# Altium schematic sheet RelayPCB1.3_schematic.schdoc
size 234 x 183 mm
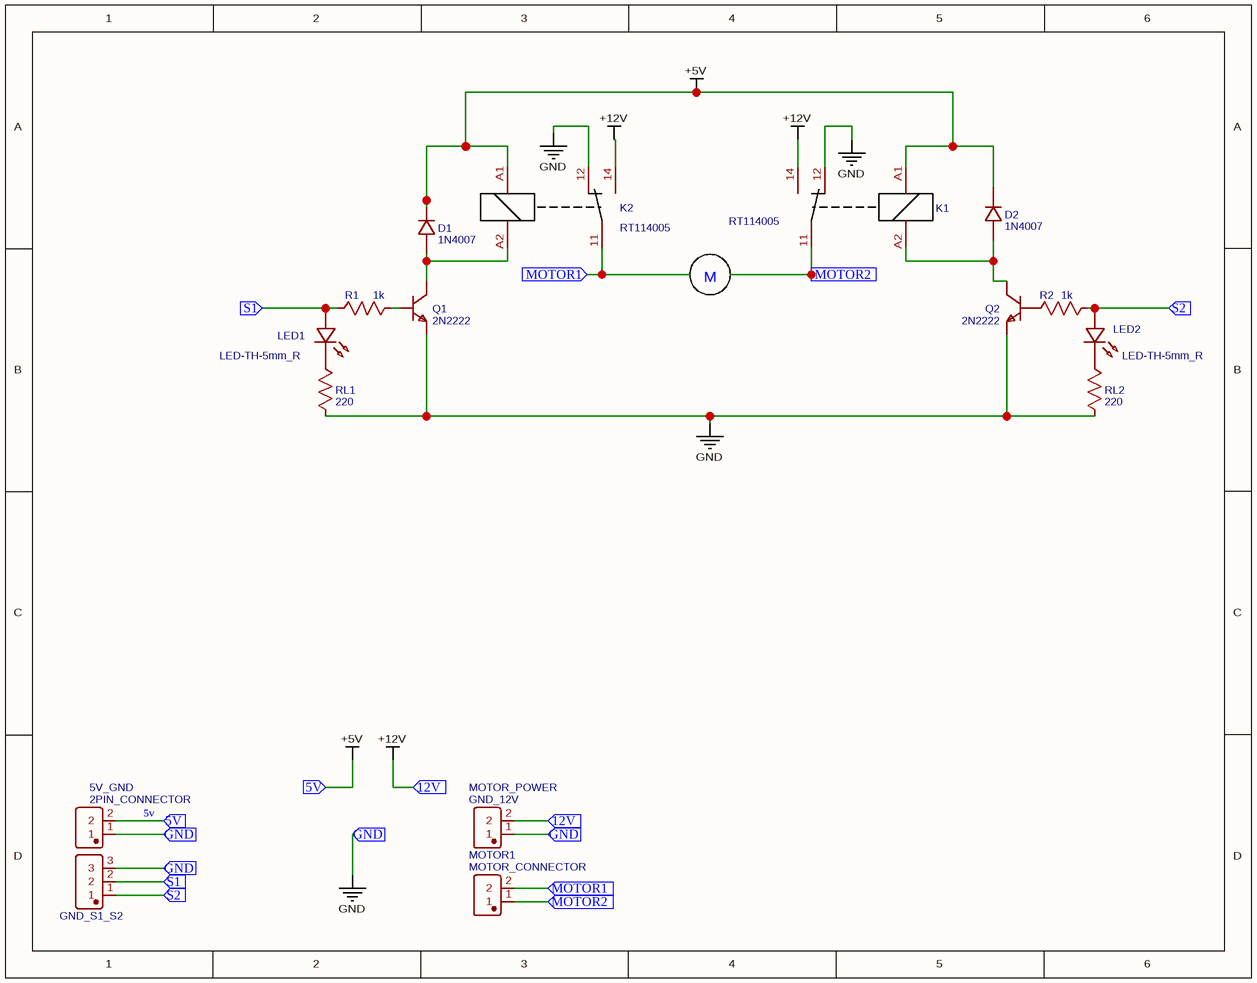
[diagram p0: RelayPCB1.3_schematic.schdoc]

## Parts
5V_GND  2PIN_CONNECTOR  [CONN-TH_XY126V-5.0-2P]
D1  1N4007  [DO-41_BD2.4-L4.7-P8.70-D0.9-RD]
D2  1N4007  [DO-41_BD2.4-L4.7-P8.70-D0.9-RD]
K1  RT114005  [SCHRACK PCB RELAIS 1393239-7]
K2  RT114005  [SCHRACK PCB RELAIS 1393239-7]
LED1  LED-TH-5mm_R  [LED-TH_BD5.0_RED]
LED2  LED-TH-5mm_R  [LED-TH_BD5.0_RED]
MOTOR1  MOTOR_CONNECTOR  [CONN-TH_XY126V-5.0-2P]
MOTOR_POWER  GND_12V  [CONN-TH_XY126V-5.0-2P]
Q1  2N2222  [TO-92-3_L4.9-W3.7-P1.27-L]
Q2  2N2222  [TO-92-3_L4.9-W3.7-P1.27-L]
R1  1k  [R_AXIAL-0.3]
R2  1k  [R_AXIAL-0.3]
RL1  220  [R_AXIAL-0.3]
RL2  220  [R_AXIAL-0.3]
U1  GND_S1_S2  [CONN-TH_XY126V-5.0-3P]

## Ports
5V (in), 12V (in), GND (in), MOTOR1 (in), MOTOR2 (in), S1 (in), S2 (in)

## Nets
5v: 5V_GND.2 D1.1 D2.1 K1.A1 K2.A1 ; port 5V  [also labelled +5V]
+12V: K1.14(A6) K2.14(A6) MOTOR_POWER.2 ; port 12V
GND: 5V_GND.1 K1.12(A5) K2.12(A5) MOTOR_POWER.1 Q1.1(E) Q2.1(E) RL1.1 RL2.1 U1.3 ; port GND
MOTOR1: K2.11 MOTOR1.2 ; port MOTOR1
MOTOR2: K1.11 MOTOR1.1 ; port MOTOR2
S1: LED1.1 R1.1 U1.2 ; port S1
S2: LED2.1 R2.2 U1.1 ; port S2
NetD1_2: D1.2 K2.A2 Q1.3(C)
NetD2_2: D2.2 K1.A2 Q2.3(C)
NetLED1_2: LED1.2 RL1.2
NetLED2_2: LED2.2 RL2.2
NetQ1_2: Q1.2(B) R1.2
NetQ2_2: Q2.2(B) R2.1

## Notes on the sheet
- M

## Library data of the parts
5V_GND = 2PIN_CONNECTOR: Manufacturer: XINLAIYA(新莱亚); Manufacturer Part: XY126V-5.0-2P; Contributor: LCSC; Supplier: LCSC; Supplier Part: C557646; JLCPCB Part Class: Extended Part; link: https://lcsc.com/eda_search?q=C557646&%26type=1&ref=editor; spicePre: U; spiceSymbolName: XY126V-5.0-2P
D1 D2 = 1N4007: Manufacturer: SEMTECH; Contributor: LCEDA_Lib; Supplier: LCSC; Manufacturer Part: 1N4007; Supplier Part: C106903; spicePre: D; spiceSymbolName: 1N4007
K1 K2 = RT114005: Manufacturer: TE; Manufacturer Part: 9-1393239-7; Contributor: Michael Fluck; Supplier: Mouser; Supplier Part: 655-9-1393239-7; link: https://www.mouser.ch/ProductDetail/TE-Connectivity-Schrack/9-1393239-7/?qs=8%252BfS01R0SwJKBf0xaFHrpA%3D%3D; spicePre: K; spiceSymbolName: Powerrelais RT114005
LED1 LED2 = LED-TH-5mm_R: Manufacturer: EVERLIGHT(台湾亿光); Manufacturer Part: 333-2SURD/S530-A3; Contributor: LCEDA_Lib; Supplier Part: C87271; Supplier: LCSC; spicePre: L; spiceSymbolName: LED-TH-5mm_R
MOTOR1 = MOTOR_CONNECTOR: Manufacturer: XINLAIYA(新莱亚); Manufacturer Part: XY126V-5.0-2P; Contributor: LCSC; Supplier: LCSC; Supplier Part: C557646; JLCPCB Part Class: Extended Part; link: https://lcsc.com/eda_search?q=C557646&%26type=1&ref=editor; spicePre: U; spiceSymbolName: XY126V-5.0-2P
MOTOR_POWER = GND_12V: Manufacturer: XINLAIYA(新莱亚); Manufacturer Part: XY126V-5.0-2P; Contributor: LCSC; Supplier: LCSC; Supplier Part: C557646; JLCPCB Part Class: Extended Part; link: https://lcsc.com/eda_search?q=C557646&%26type=1&ref=editor; spicePre: U; spiceSymbolName: XY126V-5.0-2P
Q1 Q2 = 2N2222: Manufacturer: ST(先科); Manufacturer Part: 2N2222A; Contributor: LCSC; Supplier: LCSC; Supplier Part: C118536; JLCPCB Part Class: Extended Part; link: https://lcsc.com/eda_search?q=C118536&%26type=1&ref=editor; spicePre: Q; spiceSymbolName: 2N2222
R1 R2 = 1k: nameAlias: Value(Ω); Contributor: LCEDA_Lib; spicePre: R; spiceSymbolName: R_AXIAL-0.3_US
RL1 RL2 = 220: nameAlias: Value(Ω); Contributor: LCEDA_Lib; spicePre: R; spiceSymbolName: R_AXIAL-0.3_US
U1 = GND_S1_S2: Manufacturer: XINLAIYA(新莱亚); Manufacturer Part: XY126V-5.0-3P; Contributor: LCSC; Supplier: LCSC; Supplier Part: C557647; JLCPCB Part Class: Extended Part; link: https://lcsc.com/eda_search?q=C557647&%26type=1&ref=editor; spicePre: U; spiceSymbolName: XY126V-5.0-3P